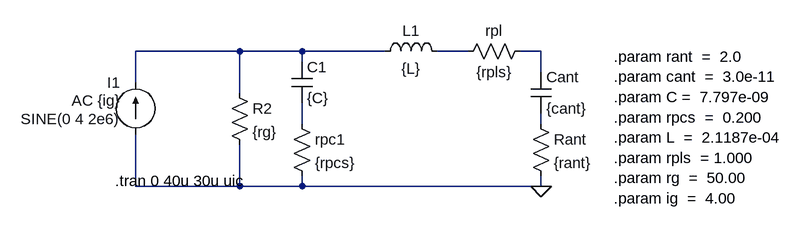
[diagram p0: schematic eje3para.asc]
eje3para.asc, the LTspice schematic file:
Version 4
SHEET 1 880 680
WIRE -96 48 -256 48
WIRE 0 48 -96 48
WIRE 128 48 0 48
WIRE 256 48 208 48
WIRE 368 48 336 48
WIRE 0 64 0 48
WIRE 368 80 368 48
WIRE -256 96 -256 48
WIRE -96 112 -96 48
WIRE 0 160 0 128
WIRE 368 160 368 144
WIRE -256 256 -256 176
WIRE -96 256 -96 192
WIRE -96 256 -256 256
WIRE 0 256 0 240
WIRE 0 256 -96 256
WIRE 368 256 368 240
WIRE 368 256 0 256
FLAG 368 256 0
SYMBOL res 352 144 R0
SYMATTR InstName Rant
SYMATTR Value {rant}
SYMBOL cap -16 64 R0
SYMATTR InstName C1
SYMATTR Value {C}
SYMATTR SpiceLine Rser=0
SYMBOL ind 112 64 R270
WINDOW 0 32 56 VTop 2
WINDOW 3 5 56 VBottom 2
SYMATTR InstName L1
SYMATTR Value {L}
SYMATTR SpiceLine Rser=0
SYMBOL res -16 144 R0
SYMATTR InstName rpc1
SYMATTR Value {rpcs}
SYMBOL res 352 32 R90
WINDOW 0 0 56 VBottom 2
WINDOW 3 32 56 VTop 2
SYMATTR InstName rpl
SYMATTR Value {rpls}
SYMBOL res -112 96 R0
SYMATTR InstName R2
SYMATTR Value {rg}
SYMBOL current -256 176 R180
WINDOW 0 24 80 Left 2
WINDOW 3 24 24 Left 2
WINDOW 123 24 52 Left 2
WINDOW 39 0 0 Left 2
SYMATTR InstName I1
SYMATTR Value SINE(0 4 2e6)
SYMATTR Value2 AC {ig}
SYMBOL cap 352 80 R0
SYMATTR InstName Cant
SYMATTR Value {cant}
TEXT -288 248 Left 2 !.tran 0 40u 30u uic
TEXT 480 56 Left 2 !.param rant  =  2.0 \n.param cant  =  3.0e-11 \n.param C =  7.797e-09 \n.param rpcs  =  0.200 \n.param L  =  2.1187e-04 \n.param rpls  = 1.000 \n.param rg  =  50.00 \n.param ig  =  4.00

The netlist it stands for:
* eje3para.asc
Rant N005 0 {rant}
C1 N001 N004 {C} Rser=0
L1 N001 N002 {L} Rser=0
rpc1 N004 0 {rpcs}
rpl N003 N002 {rpls}
R2 N001 0 {rg}
I1 0 N001 SINE(0 4 2e6) AC {ig}
Cant N003 N005 {cant}
.tran 0 40u 30u uic
.param rant  =  2.0
.param cant  =  3.0e-11
.param C =  7.797e-09
.param rpcs  =  0.200
.param L  =  2.1187e-04
.param rpls  = 1.000
.param rg  =  50.00
.param ig  =  4.00
.backanno
.end